# Altium schematic sheet uSD CARD.SchDoc
size A2; DrawnBy: UKAYACIK; Engineer: UKAYACIK; DocumentNumber: 17; Revision: B; SheetNumber: 17; SheetTotal: 21
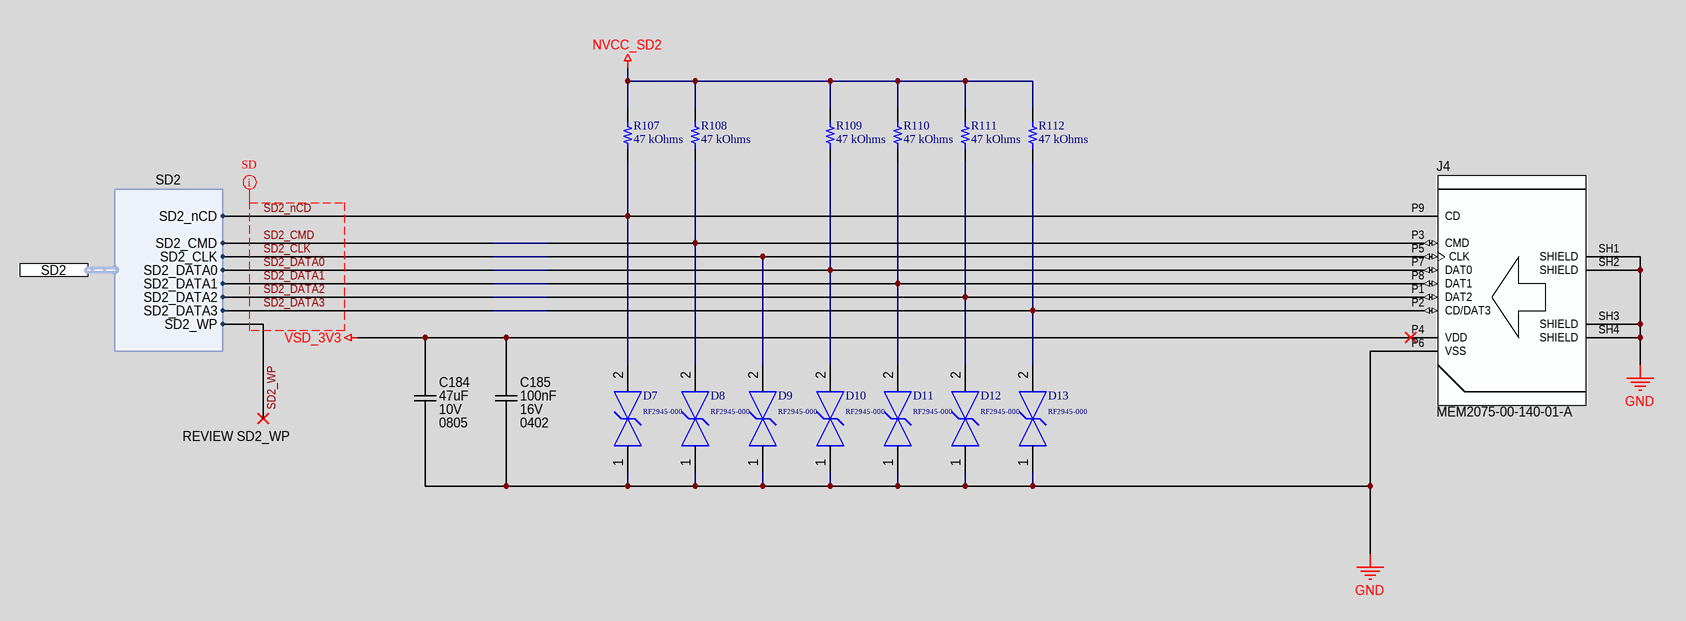
[diagram p0: uSD CARD.SchDoc]

## Parts
C184  Voltage Rating (DC): 10V  Capacitance: 47uF  Case Code (Imperial): 0805  [CAP_0805_CAPC2012X12N]  (hidden comment: C2012X5R1A476M125AC)
C185  Voltage Rating: 16V  Capacitance: 100nF  Case/Package: 0402  [CAP_0402_CAPC1005X05N]  (hidden comment: CL05B104KO5NNNC)
D7  RF2945-000  [FP-SESD0402-MFG]
D8  RF2945-000  [FP-SESD0402-MFG]
D9  RF2945-000  [FP-SESD0402-MFG]
D10  RF2945-000  [FP-SESD0402-MFG]
D11  RF2945-000  [FP-SESD0402-MFG]
D12  RF2945-000  [FP-SESD0402-MFG]
D13  RF2945-000  [FP-SESD0402-MFG]
J4  MEM2075-00-140-01-A  [CONN_MICROSD_GCT_MEM2075-00-140-01-A]
R107  47 kOhms  [RES 0402_1005]
R108  47 kOhms  [RES 0402_1005]
R109  47 kOhms  [RES 0402_1005]
R110  47 kOhms  [RES 0402_1005]
R111  47 kOhms  [RES 0402_1005]
R112  47 kOhms  [RES 0402_1005]

## Ports
SD2 (harness SD2)

## Harnesses
SD2: SD2_nCD, SD2_CMD, SD2_CLK, SD2_DATA0, SD2_DATA1, SD2_DATA2, SD2_DATA3, SD2_WP

## Nets
GND: C184.1 C185.1 D7.1 D8.1 D9.1 D10.1 D11.1 D12.1 D13.1 J4.P6(VSS) J4.SH1(SHIELD) J4.SH2(SHIELD) J4.SH3(SHIELD) J4.SH4(SHIELD)
NVCC_SD2: R107.2 R108.2 R109.2 R110.2 R111.2 R112.2
VSD_3V3: C184.2 C185.2 J4.P4(VDD)
SD2_CLK: D9.2 J4.P5(CLK) ; port SD2.SD2_CLK
SD2_CMD: D8.2 J4.P3(CMD) R108.1 ; port SD2.SD2_CMD
SD2_DATA0: D10.2 J4.P7(DAT0) R109.1 ; port SD2.SD2_DATA0
SD2_DATA1: D11.2 J4.P8(DAT1) R110.1 ; port SD2.SD2_DATA1
SD2_DATA2: D12.2 J4.P1(DAT2) R111.1 ; port SD2.SD2_DATA2
SD2_DATA3: D13.2 J4.P2(CD/DAT3) R112.1 ; port SD2.SD2_DATA3
SD2_nCD: D7.2 J4.P9(CD) R107.1 ; port SD2.SD2_nCD
SD2_WP: port SD2.SD2_WP

## Layout directives
net class MICROSD: SD2_CLK, SD2_CMD, SD2_DATA0, SD2_DATA1, SD2_DATA2, SD2_DATA3, SD2_nCD

## Notes on the sheet
- (near J4) Micro-SD
- (near J4) # Push-Push
- REVIEW SD2_WP
- PCB Des :
- Approv By :
- Project Title :
- Sheet Title :
- Date :
- Page :
- PCB Version :
- PCB Revision :
- Size :
- A2

## Library data of the parts
C184 = CAP_47UF_10V_X5R_0805: Multilayer Ceramic Capacitor, 47 uF, 10 V, ± 20%, X5R, 0805 [2012 Metric]; Manufacturer: TDK; Material: 4241ConductorMaterial; Supplier 1: Digikey; Manufacturer Part Number: C2012X5R1A476M125AC; RoHS: Yes; Category: Ceramic Capacitors; Stock 1: 476295; Pricing 1: 1=0.79, 10=0.572, 50=0.5006, 100=0.4079, 500=0.33372, 1000=0.28737 (USD); Mount: Surface Mount; Case/Package: 0805; Dielectric Material: Ceramic; Case Code (Metric): 2012; Weight: 0.000194oz; Min Operating Temperature: -55°C; Max Operating Temperature: 85°C; Tolerance: 20%; Packaging: Tape and Reel; Dielectric: X5R; Package Quantity: 1; Voltage Rating: 10V; Termination: SMD/SMT; Voltage: 10V; Series: C; Length: 2mm; Width: 0.049inch; Height: 1.25mm; Depth: 1.25mm; Thickness: 0.057inch; Lead Free: Lead Free; Reach SVHC Compliant: No; RoHS Compliant: Yes; ComponentLink1URL: https://datasheet.ciiva.com/24216/c2012x5r1a476m125ac-264921-24216523.pdf?src-supplier=Mouser; ComponentLink1Description: https://datasheet.ciiva.com/24216/c2012x5r1a476m125ac-264921-24216523.pdf?src-supplier=Mouser; ComponentLink2URL: https://datasheet.ciiva.com/24191/c2012x5r1a476m125ac-24191773.pdf?src-supplier=Future+Electronics; ComponentLink2Description: https://datasheet.ciiva.com/24191/c2012x5r1a476m125ac-24191773.pdf?src-supplier=Future+Electronics; ComponentLink3URL: https://datasheet.ciiva.com/7975/1796654-7975085.pdf?src-supplier=Element14; ComponentLink3Description: https://datasheet.ciiva.com/7975/1796654-7975085.pdf?src-supplier=Element14; ComponentLink4URL: https://datasheet.ciiva.com/22694/1796654-22694142.pdf?src-supplier=Element14; ComponentLink4Description: https://datasheet.ciiva.com/22694/1796654-22694142.pdf?src-supplier=Element14; ComponentLink5URL: https://datasheet.ciiva.com/6259/tdkmlcccaprange-6259576.pdf?src-supplier=Digikey; ComponentLink5Description: https://datasheet.ciiva.com/6259/tdkmlcccaprange-6259576.pdf?src-supplier=Digikey; ComponentLink6URL: https://datasheet.ciiva.com/6259/tdkmlcccaprange-6259575.pdf?src-supplier=Digikey; ComponentLink6Description: https://datasheet.ciiva.com/6259/tdkmlcccaprange-6259575.pdf?src-supplier=Digikey; ComponentLink7URL: https://datasheet.ciiva.com/6259/tdkmlcccaprange-6259577.pdf?src-supplier=Digikey; ComponentLink7Description: https://datasheet.ciiva.com/6259/tdkmlcccaprange-6259577.pdf?src-supplier=Digikey; Supplier Part Number 1: 445-8239-6-ND
C185 = CAP_100NF_16V_X7R_0402: Multilayer Ceramic Capacitor, 0.1 uF, 16 V, ± 10%, X7R, 0402 [1005 Metric]; Manufacturer: Samsung; Supplier 1: Digi-Key; Manufacturer Part Number: CL05B104KO5NNNC; RoHS: Yes; Category: Ceramic Capacitors; Stock 1: 11081064; Pricing 1: 1=0.1, 10=0.024, 50=0.013, 100=0.0105, 500=0.00752, 1000=0.00592, 2500=0.00538, 5000=0.00495 (USD); Mount: Surface Mount; Case Code (Metric): 1005; Case Code (Imperial): 0402; Material: Ceramic; Min Operating Temperature: -55°C; Max Operating Temperature: 125°C; Tolerance: 10%; Package Quantity: 1; Packaging: Tape and Reel; Dielectric: X7R; Series: CL; Voltage: 16V; Voltage Rating (DC): 16V; Construction: Flat; Length: 1mm; Width: 0.02inch; Height: 0.5mm; Thickness: 0.022inch; Depth: 0.5mm; Radiation Hardening: No; RoHS Compliant: Yes; Lead Free: Lead Free; ComponentLink1URL: https://datasheet.ciiva.com/26920/getdatasheetpartid-359683-26920169.pdf?src-supplier=Verical; ComponentLink1Description: https://datasheet.ciiva.com/26920/getdatasheetpartid-359683-26920169.pdf?src-supplier=Verical; ComponentLink2URL: https://datasheet.ciiva.com/29198/458718-da-01-en-vs-kondensator-0402-29198423.pdf?src-supplier=Conrad; ComponentLink2Description: https://datasheet.ciiva.com/29198/458718-da-01-en-vs-kondensator-0402-29198423.pdf?src-supplier=Conrad; ComponentLink3URL: https://datasheet.ciiva.com/16208/cl05b104kq5nnnc-16208343.pdf?src-supplier=Future+Electronics; ComponentLink3Description: https://datasheet.ciiva.com/16208/cl05b104kq5nnnc-16208343.pdf?src-supplier=Future+Electronics; ComponentLink4URL: https://datasheet.ciiva.com/26309/mlcc-catalogdownload2013-eng-26309003.pdf?src-supplier=Distrelec; ComponentLink4Description: https://datasheet.ciiva.com/26309/mlcc-catalogdownload2013-eng-26309003.pdf?src-supplier=Distrelec; Supplier Part Number 1: 1276-1001-6-ND
D7-D13 = CMP-08607-000062-1: TVS DIODE 7V 10V 0402; Manufacturer: Littelfuse; Value: 0.1pF; Breakdown Voltage: 9.8V; Number Of Channels: 1; Peak Pulse Current: 2A; Direction: Bidirectional; Automotive Grade: Grade 1; Standoff Height: 0mm; Octopart: https://octopart.com/rf2945-000-littelfuse-56516902; Device Class L3: unset; ComponentLink2Description: Datasheet; Lead Free: Yes; Temperature Range Low: -55°C; Clamping Voltage: 10V; Digikey Description: TVS DIODE 7V 10V 0402; Category: Diode; Temperature: -55°C to +125°C; Device Class L1: Circuit Protection; Capacitance: 0.1pF; RoHS: TRUE; Device Class L2: TVS Diodes; Package: SESD0402; Reverse Standoff Voltage: 7V; Automotive: Yes; Height: 0.43mm; Manufacturer Part Number: RF2945-000; Temperature Range High: +125°C; ComponentLink2URL: https://www.littelfuse.com/~/media/electronics/datasheets/tvs_diode_arrays/littelfuse_tvs_diode_array_sesd_ultra_low_capacitance_discrete_tvs_datasheet.pdf.pdf
J4 = CONN_MICROSD_MEM2075-00-140-01-A: Memory Card Connectors Micro SD Push-Push, SMT, 1.40mm Profile, With Peg, Open Switch, T&R; Manufacturer: Global Connector Technology; Supplier 1: Verical; Manufacturer Part Number: MEM2075-00-140-01-A; RoHS: No; Category: Connectors; Stock 1: 1000; Pricing 1: 1000=1.6923 (USD); Mount: Surface Mount; Number of Pins: 8NUMBER; Contact Plating: Gold; Housing Material: 4896ConductorMaterial; Connector Type: Connector; Series: MEM2075; Packaging: Tape and Reel; ComponentLink1URL: https://gct.co/files/drawings/mem2075.pdf?src-supplier=Digikey; ComponentLink1Description: https://gct.co/files/drawings/mem2075.pdf?src-supplier=Digikey; ComponentLink2URL: https://datasheet.octopart.com/MEM2075-00-140-01-A-GCT-datasheet-166929309.pdf?src-supplier=TME; ComponentLink2Description: https://datasheet.octopart.com/MEM2075-00-140-01-A-GCT-datasheet-166929309.pdf?src-supplier=TME; Supplier Part Number 1: MEM2075-00-140-01-A
R107-R112 = RMCF0402FT47K0: RES 47K OHM 1% 1/16W 0402; Manufacturer: Stackpole Electronics Inc; Power (Watts): 0.063W, 1/16W; Temperature Coefficient: ±100ppm/°C; Part Number: RMCF0402FT47K0; Value: 47 kOhms; ComponentLink1Description: Datasheet; ComponentLink1URL: https://www.seielect.com/catalog/sei-rmcf_rmcp.pdf; ComponentLink2Description: DigiKey Link; ComponentLink2URL: https://www.digikey.com/en/products/detail/stackpole-electronics-inc/RMCF0402FT47K0/1714749; Composition: Thick Film; Device Package: 0402 (1005 Metric); Features: Automotive AEC-Q200; Height - Seated (Max): 0.016" (0.40mm); LastUpdated: 2/9/2024 8:30:13 PM; Lifecycle Status: Active; Minimum Order: 1; Number of Terminations: 2; Operating Temperature: -55°C ~ 155°C; Package / Case: 0402 (1005 Metric); Packaging: CutTape; PartId: 4957; Part Status: Active; Price: 0.01; Ratings: AEC-Q200; Resistance: 47 kOhms; Series: RMCF; Size / Dimension: 0.039" L x 0.020" W (1.00mm x 0.50mm); Supplier 1: DigiKey; Supplier Part Number 1: RMCF0402FT47K0CT-ND; Supplier Device Package: 0402; Tolerance: ±1%